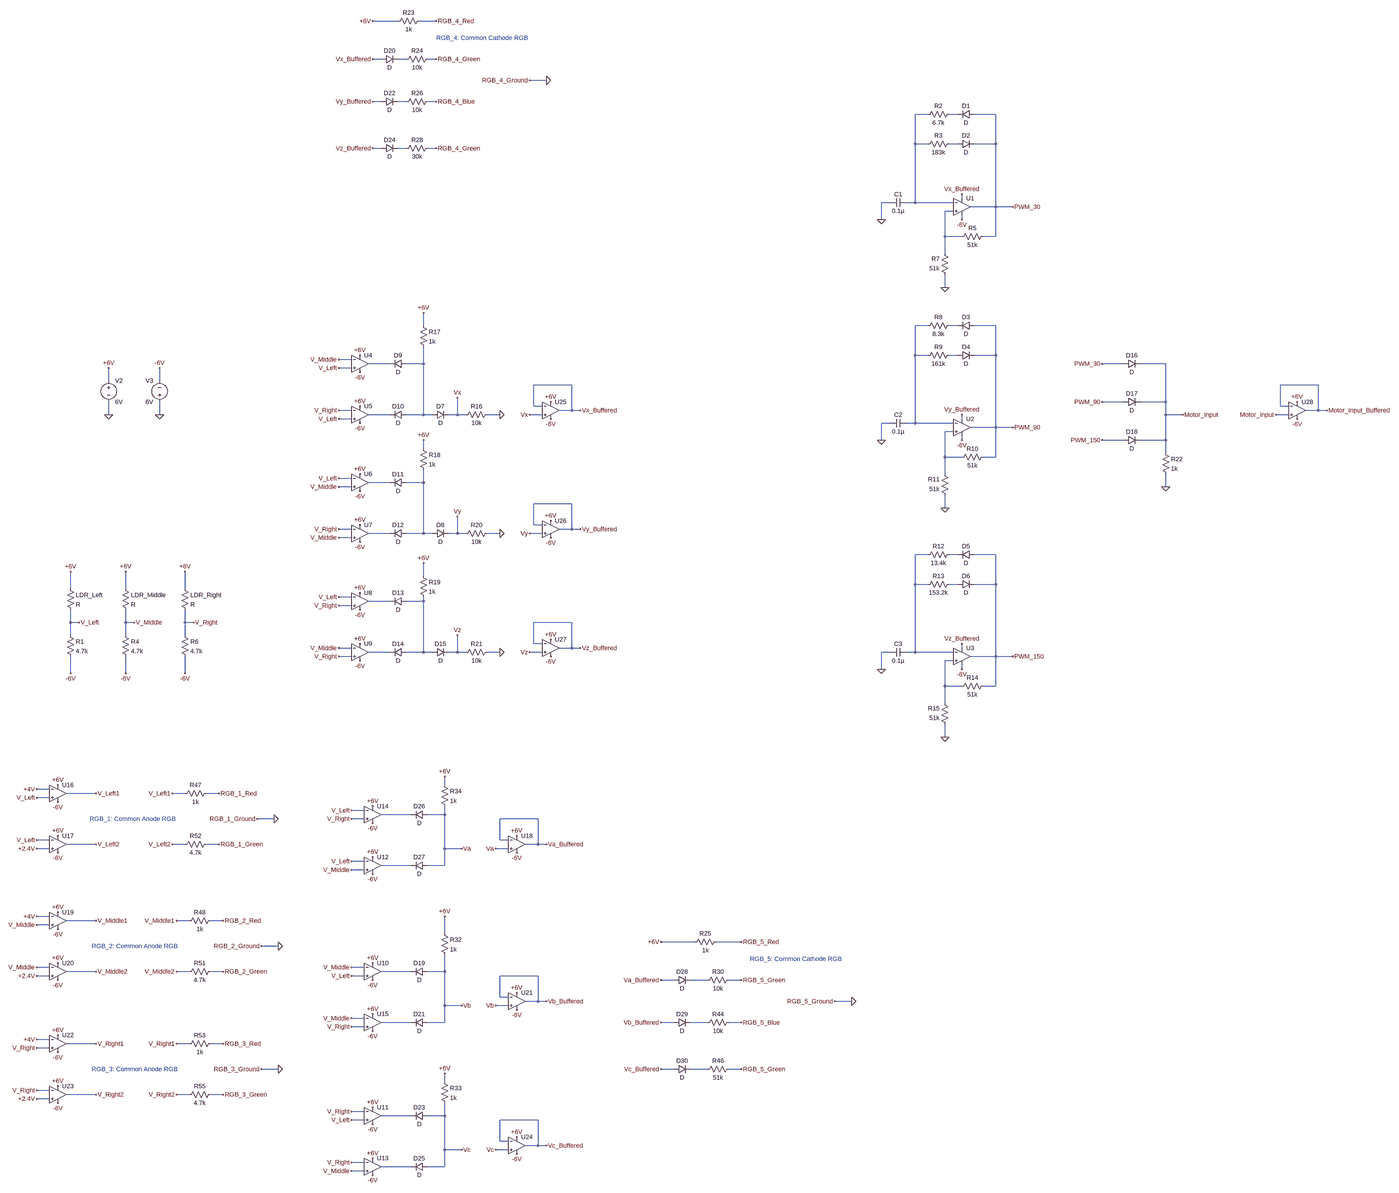
[diagram p0: schematic Project Schematic.asc, whole sheet]
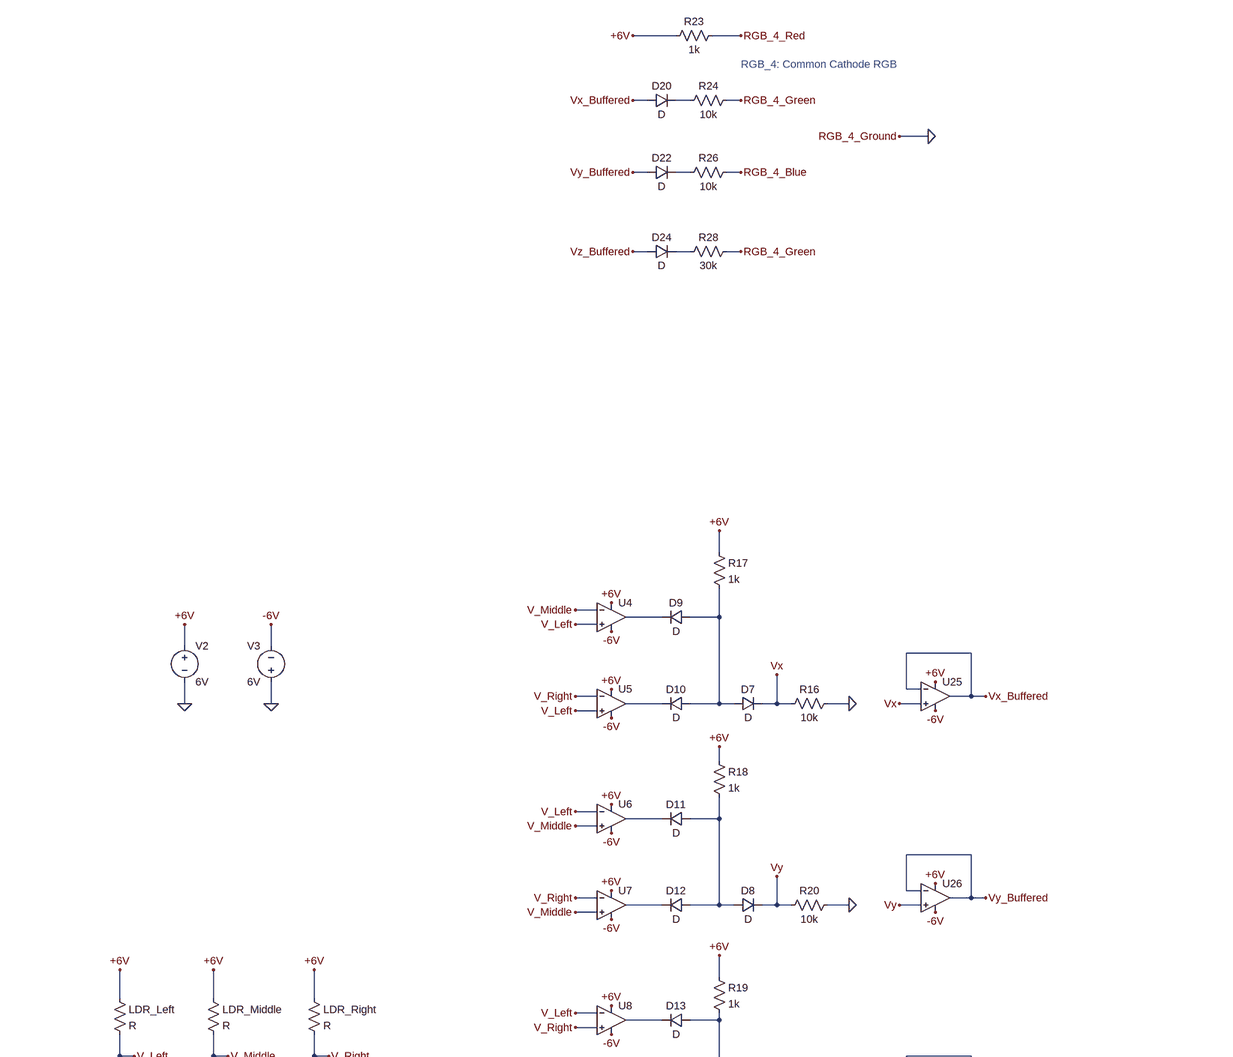
[diagram p1: schematic Project Schematic.asc, part, row 1 of 2, column 1 of 2]
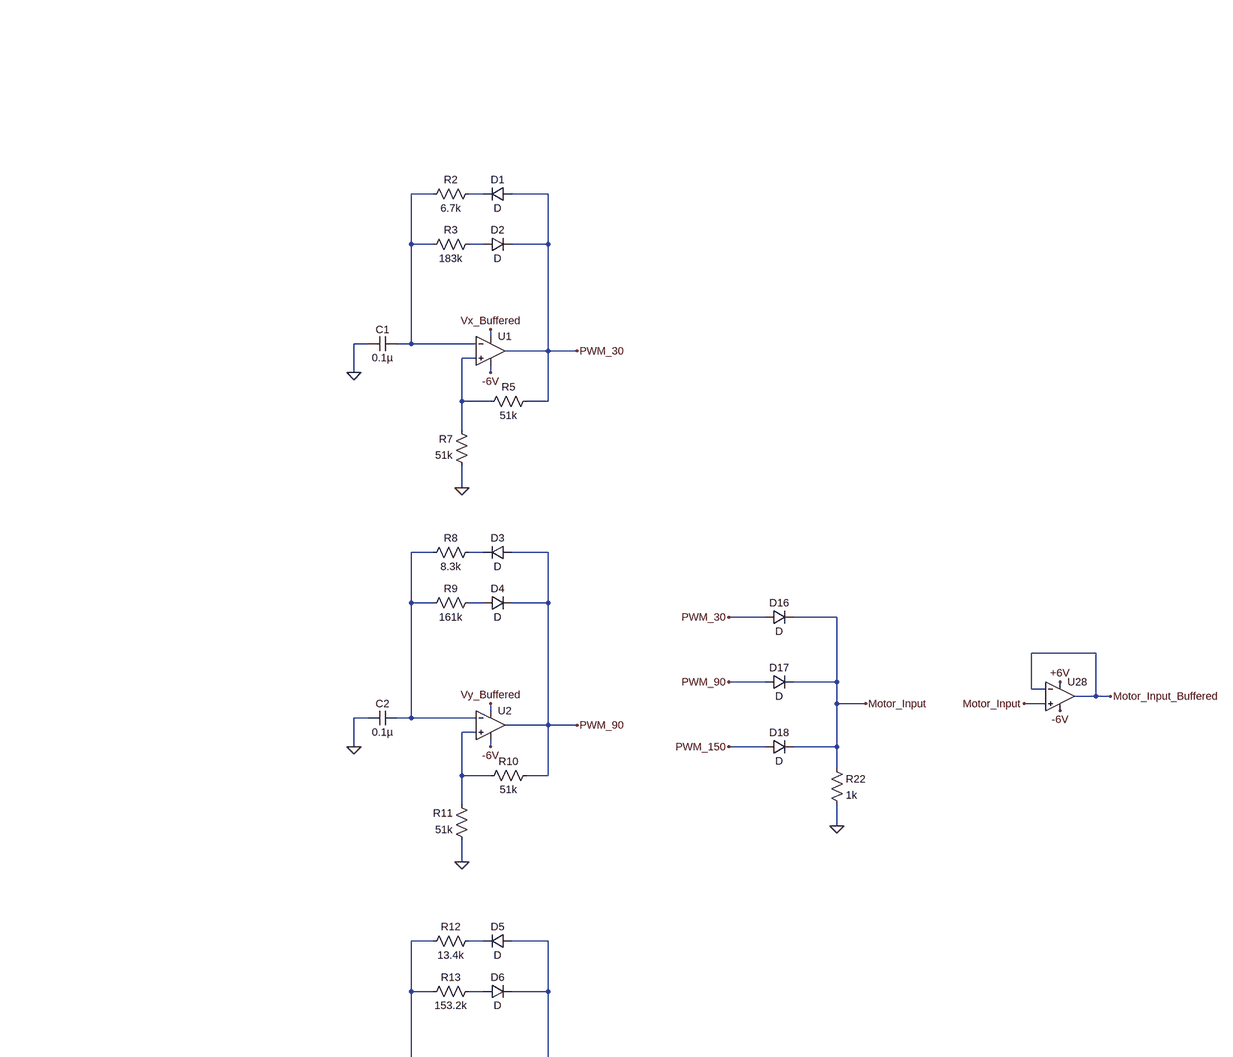
[diagram p2: schematic Project Schematic.asc, part, row 1 of 2, column 2 of 2]
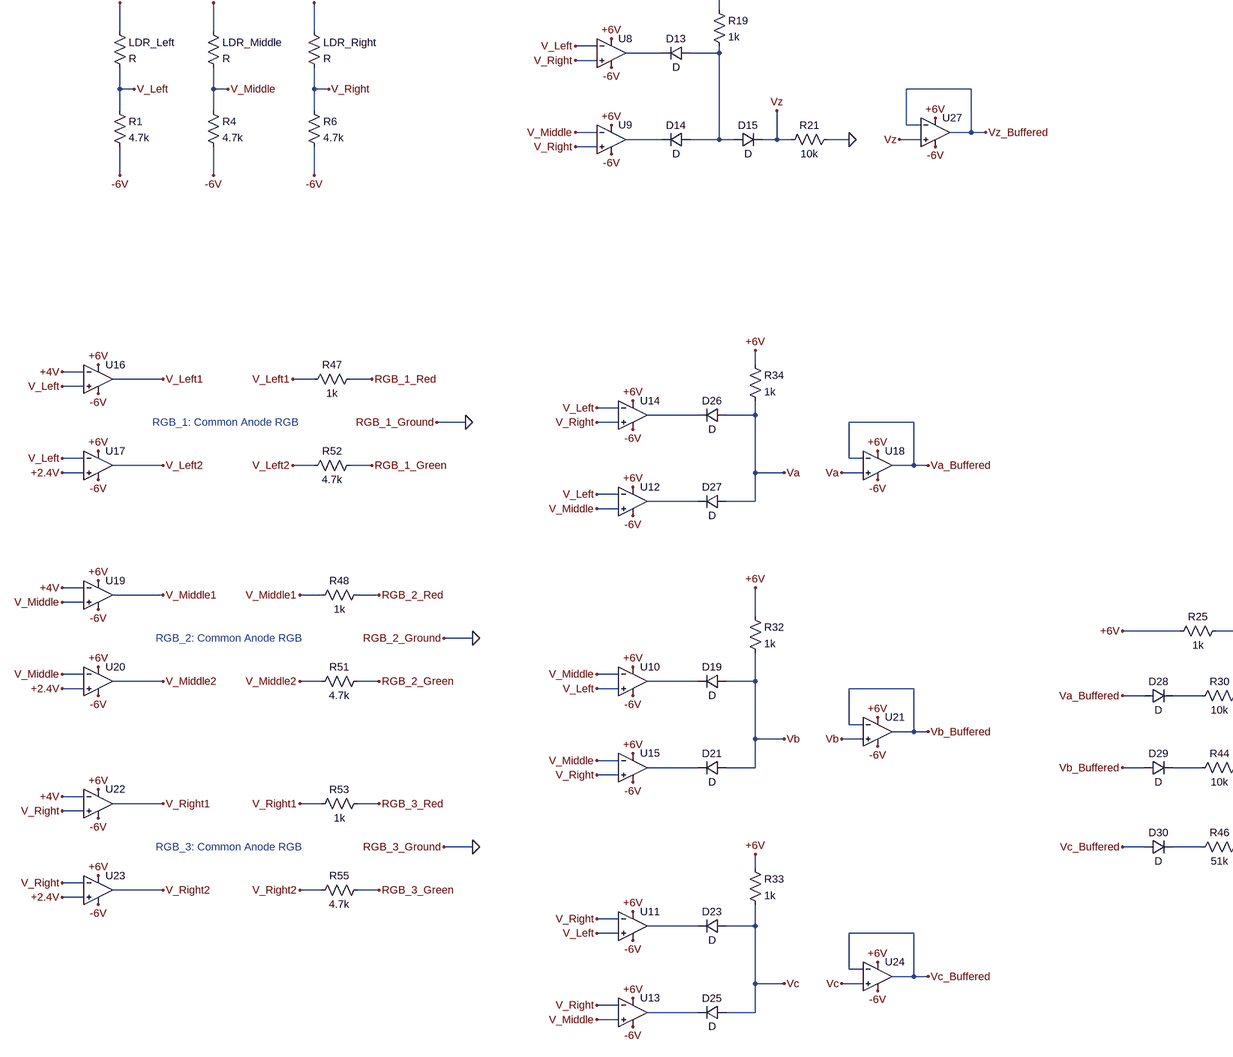
[diagram p3: schematic Project Schematic.asc, part, row 2 of 2, column 1 of 2]
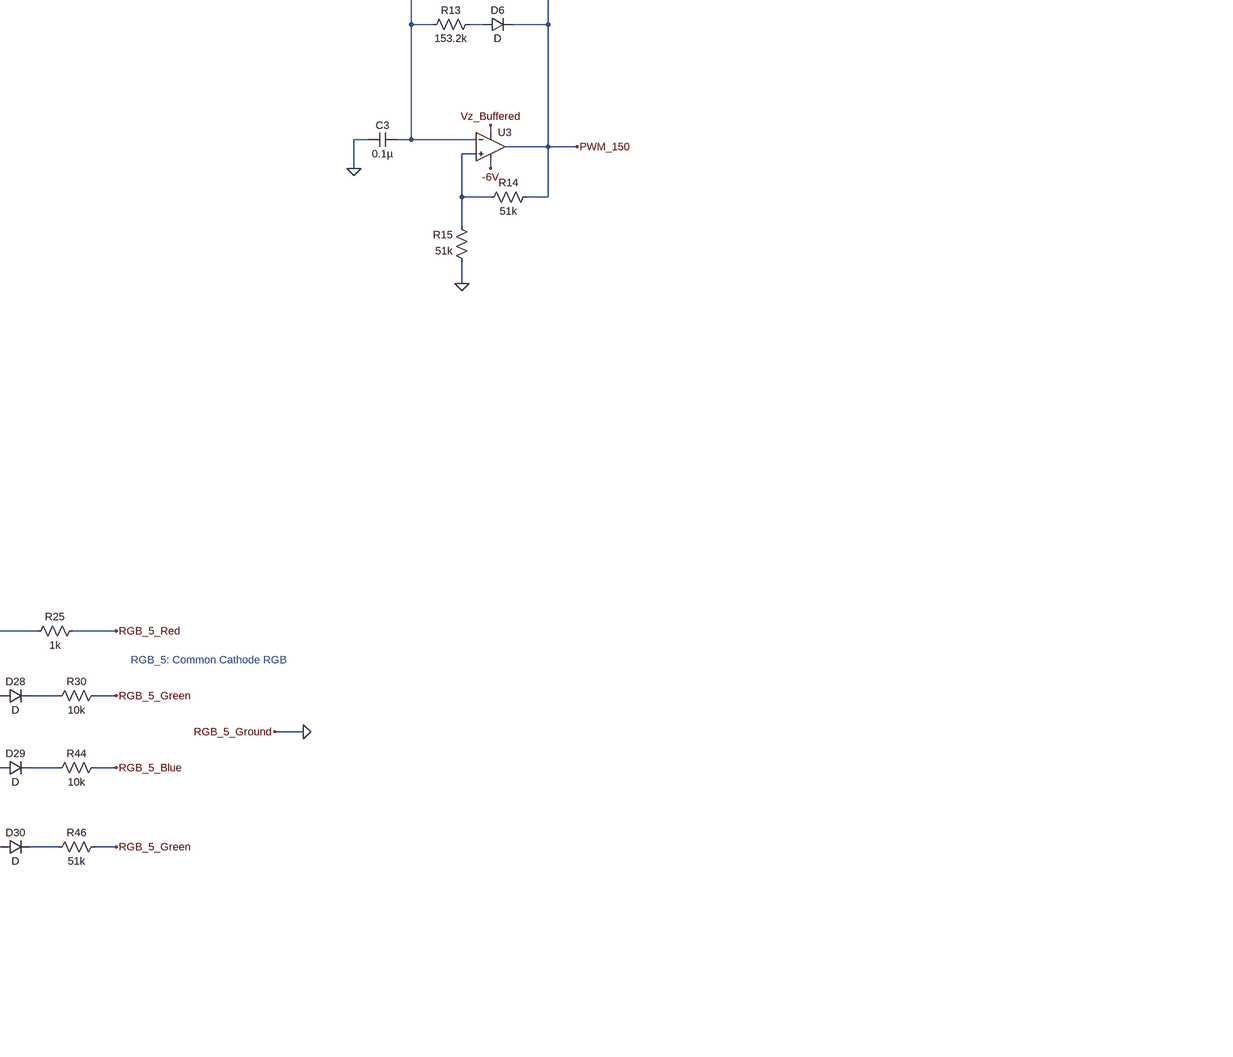
[diagram p4: schematic Project Schematic.asc, part, row 2 of 2, column 2 of 2]
Project Schematic.asc, the LTspice schematic file:
Version 4
SHEET 1 7268 3324
WIRE 2224 -2096 2128 -2096
WIRE 2368 -2096 2304 -2096
WIRE 2160 -1952 2128 -1952
WIRE 2256 -1952 2224 -1952
WIRE 2368 -1952 2336 -1952
WIRE 2784 -1872 2720 -1872
WIRE 2160 -1792 2128 -1792
WIRE 2256 -1792 2224 -1792
WIRE 2368 -1792 2336 -1792
WIRE 4224 -1744 4176 -1744
WIRE 4336 -1744 4304 -1744
WIRE 4480 -1744 4400 -1744
WIRE 4176 -1632 4176 -1744
WIRE 4224 -1632 4176 -1632
WIRE 4336 -1632 4304 -1632
WIRE 4480 -1632 4480 -1744
WIRE 4480 -1632 4400 -1632
WIRE 2160 -1616 2128 -1616
WIRE 2256 -1616 2224 -1616
WIRE 2368 -1616 2336 -1616
WIRE 4352 -1392 4352 -1408
WIRE 4080 -1376 4048 -1376
WIRE 4176 -1376 4176 -1632
WIRE 4176 -1376 4144 -1376
WIRE 4320 -1376 4176 -1376
WIRE 4480 -1360 4480 -1632
WIRE 4480 -1360 4384 -1360
WIRE 4544 -1360 4480 -1360
WIRE 4320 -1344 4288 -1344
WIRE 4048 -1312 4048 -1376
WIRE 4352 -1312 4352 -1328
WIRE 4288 -1248 4288 -1344
WIRE 4352 -1248 4288 -1248
WIRE 4480 -1248 4480 -1360
WIRE 4480 -1248 4432 -1248
WIRE 4288 -1184 4288 -1248
WIRE 4288 -1056 4288 -1104
WIRE 2320 -912 2320 -960
WIRE 4224 -912 4176 -912
WIRE 4336 -912 4304 -912
WIRE 4480 -912 4400 -912
WIRE 4176 -800 4176 -912
WIRE 4224 -800 4176 -800
WIRE 4336 -800 4304 -800
WIRE 4480 -800 4480 -912
WIRE 4480 -800 4400 -800
WIRE 2048 -784 2000 -784
WIRE 2192 -768 2112 -768
WIRE 2320 -768 2320 -832
WIRE 2320 -768 2256 -768
WIRE 5120 -768 5040 -768
WIRE 5280 -768 5184 -768
WIRE 2048 -752 2000 -752
WIRE 480 -704 480 -752
WIRE 672 -704 672 -752
WIRE 2880 -688 2736 -688
WIRE 5856 -688 5712 -688
WIRE 5120 -624 5040 -624
WIRE 5280 -624 5280 -768
WIRE 5280 -624 5184 -624
WIRE 2736 -608 2736 -688
WIRE 2768 -608 2736 -608
WIRE 5712 -608 5712 -688
WIRE 5744 -608 5712 -608
WIRE 2048 -592 2000 -592
WIRE 2880 -592 2880 -688
WIRE 2880 -592 2832 -592
WIRE 2912 -592 2880 -592
WIRE 5856 -592 5856 -688
WIRE 5856 -592 5808 -592
WIRE 5888 -592 5856 -592
WIRE 480 -576 480 -624
WIRE 672 -576 672 -624
WIRE 2192 -576 2112 -576
WIRE 2320 -576 2320 -768
WIRE 2320 -576 2256 -576
WIRE 2352 -576 2320 -576
WIRE 2448 -576 2448 -640
WIRE 2448 -576 2416 -576
WIRE 2480 -576 2448 -576
WIRE 2608 -576 2560 -576
WIRE 2768 -576 2720 -576
WIRE 5280 -576 5280 -624
WIRE 5344 -576 5280 -576
WIRE 5744 -576 5696 -576
WIRE 2048 -560 2000 -560
WIRE 4352 -560 4352 -576
WIRE 4080 -544 4048 -544
WIRE 4176 -544 4176 -800
WIRE 4176 -544 4144 -544
WIRE 4320 -544 4176 -544
WIRE 4480 -528 4480 -800
WIRE 4480 -528 4384 -528
WIRE 4544 -528 4480 -528
WIRE 4320 -512 4288 -512
WIRE 4048 -480 4048 -544
WIRE 4352 -480 4352 -496
WIRE 5120 -480 5040 -480
WIRE 5280 -480 5280 -576
WIRE 5280 -480 5184 -480
WIRE 2320 -448 2320 -480
WIRE 5280 -432 5280 -480
WIRE 4288 -416 4288 -512
WIRE 4352 -416 4288 -416
WIRE 4480 -416 4480 -528
WIRE 4480 -416 4432 -416
WIRE 4288 -352 4288 -416
WIRE 2048 -336 2000 -336
WIRE 2192 -320 2112 -320
WIRE 2320 -320 2320 -368
WIRE 2320 -320 2256 -320
WIRE 2048 -304 2000 -304
WIRE 5280 -304 5280 -352
WIRE 2880 -240 2736 -240
WIRE 4288 -224 4288 -272
WIRE 2736 -160 2736 -240
WIRE 2768 -160 2736 -160
WIRE 2048 -144 2000 -144
WIRE 2880 -144 2880 -240
WIRE 2880 -144 2832 -144
WIRE 2912 -144 2880 -144
WIRE 2192 -128 2112 -128
WIRE 2320 -128 2320 -320
WIRE 2320 -128 2256 -128
WIRE 2352 -128 2320 -128
WIRE 2448 -128 2448 -192
WIRE 2448 -128 2416 -128
WIRE 2480 -128 2448 -128
WIRE 2608 -128 2560 -128
WIRE 2768 -128 2720 -128
WIRE 2048 -112 2000 -112
WIRE 4224 -48 4176 -48
WIRE 4336 -48 4304 -48
WIRE 4480 -48 4400 -48
WIRE 2320 32 2320 -16
WIRE 4176 64 4176 -48
WIRE 4224 64 4176 64
WIRE 4336 64 4304 64
WIRE 4480 64 4480 -48
WIRE 4480 64 4400 64
WIRE 336 80 336 16
WIRE 544 80 544 16
WIRE 768 80 768 16
WIRE 2048 112 2000 112
WIRE 2192 128 2112 128
WIRE 2320 128 2320 112
WIRE 2320 128 2256 128
WIRE 2048 144 2000 144
WIRE 336 208 336 160
WIRE 368 208 336 208
WIRE 544 208 544 160
WIRE 576 208 544 208
WIRE 768 208 768 160
WIRE 800 208 768 208
WIRE 2880 208 2736 208
WIRE 336 256 336 208
WIRE 544 256 544 208
WIRE 768 256 768 208
WIRE 2736 288 2736 208
WIRE 2768 288 2736 288
WIRE 2048 304 2000 304
WIRE 2880 304 2880 208
WIRE 2880 304 2832 304
WIRE 2912 304 2880 304
WIRE 4352 304 4352 288
WIRE 2192 320 2112 320
WIRE 2320 320 2320 128
WIRE 2320 320 2256 320
WIRE 2352 320 2320 320
WIRE 2448 320 2448 256
WIRE 2448 320 2416 320
WIRE 2480 320 2448 320
WIRE 2608 320 2560 320
WIRE 2768 320 2720 320
WIRE 4080 320 4048 320
WIRE 4176 320 4176 64
WIRE 4176 320 4144 320
WIRE 4320 320 4176 320
WIRE 2048 336 2000 336
WIRE 4480 336 4480 64
WIRE 4480 336 4384 336
WIRE 4544 336 4480 336
WIRE 4320 352 4288 352
WIRE 4048 384 4048 320
WIRE 4352 384 4352 368
WIRE 336 400 336 336
WIRE 544 400 544 336
WIRE 768 400 768 336
WIRE 4288 448 4288 352
WIRE 4352 448 4288 448
WIRE 4480 448 4480 336
WIRE 4480 448 4432 448
WIRE 4288 512 4288 448
WIRE 4288 640 4288 592
WIRE 2400 1104 2400 1072
WIRE 256 1120 208 1120
WIRE 432 1136 320 1136
WIRE 768 1136 720 1136
WIRE 896 1136 848 1136
WIRE 256 1152 208 1152
WIRE 2096 1200 2048 1200
WIRE 2272 1216 2160 1216
WIRE 2400 1216 2400 1184
WIRE 2400 1216 2336 1216
WIRE 1104 1232 1040 1232
WIRE 2096 1232 2048 1232
WIRE 2752 1232 2608 1232
WIRE 256 1312 208 1312
WIRE 2608 1312 2608 1232
WIRE 2640 1312 2608 1312
WIRE 432 1328 320 1328
WIRE 768 1328 720 1328
WIRE 896 1328 848 1328
WIRE 2752 1328 2752 1232
WIRE 2752 1328 2704 1328
WIRE 2784 1328 2752 1328
WIRE 256 1344 208 1344
WIRE 2400 1344 2400 1216
WIRE 2464 1344 2400 1344
WIRE 2640 1344 2592 1344
WIRE 2096 1392 2048 1392
WIRE 2272 1408 2160 1408
WIRE 2400 1408 2400 1344
WIRE 2400 1408 2336 1408
WIRE 2096 1424 2048 1424
WIRE 256 1600 208 1600
WIRE 432 1616 320 1616
WIRE 784 1616 736 1616
WIRE 912 1616 864 1616
WIRE 256 1632 208 1632
WIRE 2400 1664 2400 1600
WIRE 3344 1696 3216 1696
WIRE 3520 1696 3424 1696
WIRE 1120 1712 1056 1712
WIRE 256 1792 208 1792
WIRE 2096 1792 2048 1792
WIRE 432 1808 320 1808
WIRE 784 1808 736 1808
WIRE 912 1808 864 1808
WIRE 2272 1808 2160 1808
WIRE 2400 1808 2400 1744
WIRE 2400 1808 2336 1808
WIRE 256 1824 208 1824
WIRE 2096 1824 2048 1824
WIRE 2752 1824 2608 1824
WIRE 3264 1840 3216 1840
WIRE 3392 1840 3328 1840
WIRE 3520 1840 3472 1840
WIRE 2608 1904 2608 1824
WIRE 2640 1904 2608 1904
WIRE 2752 1920 2752 1824
WIRE 2752 1920 2704 1920
WIRE 2784 1920 2752 1920
WIRE 3936 1920 3872 1920
WIRE 2400 1936 2400 1808
WIRE 2464 1936 2400 1936
WIRE 2640 1936 2592 1936
WIRE 2096 1984 2048 1984
WIRE 2272 2000 2160 2000
WIRE 2400 2000 2400 1936
WIRE 2400 2000 2336 2000
WIRE 3264 2000 3216 2000
WIRE 3392 2000 3328 2000
WIRE 3520 2000 3472 2000
WIRE 2096 2016 2048 2016
WIRE 256 2064 208 2064
WIRE 432 2080 320 2080
WIRE 784 2080 736 2080
WIRE 912 2080 864 2080
WIRE 256 2096 208 2096
WIRE 1120 2176 1056 2176
WIRE 3264 2176 3216 2176
WIRE 3392 2176 3328 2176
WIRE 3520 2176 3472 2176
WIRE 2400 2224 2400 2192
WIRE 256 2256 208 2256
WIRE 432 2272 320 2272
WIRE 784 2272 736 2272
WIRE 912 2272 864 2272
WIRE 256 2288 208 2288
WIRE 2096 2336 2048 2336
WIRE 2272 2352 2160 2352
WIRE 2400 2352 2400 2304
WIRE 2400 2352 2336 2352
WIRE 2096 2368 2048 2368
WIRE 2752 2368 2608 2368
WIRE 2608 2448 2608 2368
WIRE 2640 2448 2608 2448
WIRE 2752 2464 2752 2368
WIRE 2752 2464 2704 2464
WIRE 2784 2464 2752 2464
WIRE 2400 2480 2400 2352
WIRE 2464 2480 2400 2480
WIRE 2640 2480 2592 2480
WIRE 2096 2528 2048 2528
WIRE 2272 2544 2160 2544
WIRE 2400 2544 2400 2480
WIRE 2400 2544 2336 2544
WIRE 2096 2560 2048 2560
FLAG 368 208 V_Left
FLAG 576 208 V_Middle
FLAG 800 208 V_Right
FLAG 4048 -1312 0
FLAG 4288 -1056 0
FLAG 4048 -480 0
FLAG 4288 -224 0
FLAG 4048 384 0
FLAG 4288 640 0
FLAG 4352 -1408 Vx_Buffered
FLAG 4352 -576 Vy_Buffered
FLAG 4352 288 Vz_Buffered
FLAG 2000 -560 V_Left
FLAG 2000 -752 V_Left
FLAG 2000 -784 V_Middle
FLAG 2000 -304 V_Middle
FLAG 2000 -112 V_Middle
FLAG 2000 304 V_Middle
FLAG 2000 -592 V_Right
FLAG 2000 -144 V_Right
FLAG 2000 144 V_Right
FLAG 2000 336 V_Right
FLAG 2000 -336 V_Left
FLAG 2000 112 V_Left
FLAG 4544 -1360 PWM_30
FLAG 4544 -528 PWM_90
FLAG 4544 336 PWM_150
FLAG 672 -576 0
FLAG 480 -576 0
FLAG 2608 -576 0
FLAG 2608 -128 0
FLAG 2608 320 0
FLAG 2448 -640 Vx
FLAG 2448 -192 Vy
FLAG 2448 256 Vz
FLAG 480 -752 +6V
FLAG 2080 -800 +6V
FLAG 2080 -352 +6V
FLAG 2080 -608 +6V
FLAG 2080 -160 +6V
FLAG 2080 96 +6V
FLAG 2080 288 +6V
FLAG 2320 -16 +6V
FLAG 2320 -480 +6V
FLAG 2320 -960 +6V
FLAG 672 -752 -6V
FLAG 2080 -288 -6V
FLAG 2080 -96 -6V
FLAG 2080 160 -6V
FLAG 2080 352 -6V
FLAG 2080 -736 -6V
FLAG 2080 -544 -6V
FLAG 5040 -768 PWM_30
FLAG 5040 -624 PWM_90
FLAG 5040 -480 PWM_150
FLAG 5280 -304 0
FLAG 5344 -576 Motor_Input
FLAG 2128 -1952 Vx_Buffered
FLAG 2128 -1792 Vy_Buffered
FLAG 2128 -1616 Vz_Buffered
FLAG 2368 -1792 RGB_4_Blue
FLAG 2368 -1952 RGB_4_Green
FLAG 2368 -1616 RGB_4_Green
FLAG 2784 -1872 0
FLAG 2720 -1872 RGB_4_Ground
FLAG 4352 -1312 -6V
FLAG 4352 384 -6V
FLAG 4352 -480 -6V
FLAG 336 16 +6V
FLAG 544 16 +6V
FLAG 768 16 +6V
FLAG 336 400 -6V
FLAG 544 400 -6V
FLAG 768 400 -6V
FLAG 2048 2368 V_Left
FLAG 2048 1824 V_Left
FLAG 2048 1792 V_Middle
FLAG 2048 1424 V_Middle
FLAG 2048 2560 V_Middle
FLAG 2048 1984 V_Middle
FLAG 2048 2336 V_Right
FLAG 2048 2528 V_Right
FLAG 2048 1232 V_Right
FLAG 2048 2016 V_Right
FLAG 2048 1392 V_Left
FLAG 2048 1200 V_Left
FLAG 2128 1776 +6V
FLAG 2128 1376 +6V
FLAG 2128 2320 +6V
FLAG 2128 2512 +6V
FLAG 2128 1184 +6V
FLAG 2128 1968 +6V
FLAG 2128 1440 -6V
FLAG 2128 2576 -6V
FLAG 2128 1248 -6V
FLAG 2128 2032 -6V
FLAG 2128 1840 -6V
FLAG 2128 2384 -6V
FLAG 208 1152 V_Left
FLAG 208 1312 V_Left
FLAG 208 1120 +4V
FLAG 288 1104 +6V
FLAG 288 1296 +6V
FLAG 288 1168 -6V
FLAG 288 1360 -6V
FLAG 208 1632 V_Middle
FLAG 208 1792 V_Middle
FLAG 208 1600 +4V
FLAG 288 1584 +6V
FLAG 288 1776 +6V
FLAG 288 1648 -6V
FLAG 288 1840 -6V
FLAG 208 2096 V_Right
FLAG 208 2256 V_Right
FLAG 208 2064 +4V
FLAG 288 2048 +6V
FLAG 288 2240 +6V
FLAG 288 2112 -6V
FLAG 288 2304 -6V
FLAG 432 1136 V_Left1
FLAG 432 1328 V_Left2
FLAG 432 1616 V_Middle1
FLAG 432 1808 V_Middle2
FLAG 432 2080 V_Right1
FLAG 432 2272 V_Right2
FLAG 3216 1840 Va_Buffered
FLAG 3216 2000 Vb_Buffered
FLAG 3216 2176 Vc_Buffered
FLAG 3520 2000 RGB_5_Blue
FLAG 3520 1840 RGB_5_Green
FLAG 3520 2176 RGB_5_Green
FLAG 3936 1920 0
FLAG 3872 1920 RGB_5_Ground
FLAG 720 1136 V_Left1
FLAG 720 1328 V_Left2
FLAG 896 1136 RGB_1_Red
FLAG 896 1328 RGB_1_Green
FLAG 1104 1232 0
FLAG 1040 1232 RGB_1_Ground
FLAG 736 1616 V_Middle1
FLAG 736 1808 V_Middle2
FLAG 912 1616 RGB_2_Red
FLAG 912 1808 RGB_2_Green
FLAG 1120 1712 0
FLAG 1056 1712 RGB_2_Ground
FLAG 736 2080 V_Right1
FLAG 736 2272 V_Right2
FLAG 912 2080 RGB_3_Red
FLAG 912 2272 RGB_3_Green
FLAG 1120 2176 0
FLAG 1056 2176 RGB_3_Ground
FLAG 208 1344 +2.4V
FLAG 208 1824 +2.4V
FLAG 208 2288 +2.4V
FLAG 2368 -2096 RGB_4_Red
FLAG 2128 -2096 +6V
FLAG 2400 1600 +6V
FLAG 2400 2192 +6V
FLAG 2400 1072 +6V
FLAG 2464 1344 Va
FLAG 2464 1936 Vb
FLAG 2464 2480 Vc
FLAG 3520 1696 RGB_5_Red
FLAG 3216 1696 +6V
FLAG 2672 1296 +6V
FLAG 2672 1360 -6V
FLAG 2592 1344 Va
FLAG 2784 1328 Va_Buffered
FLAG 2672 1888 +6V
FLAG 2672 1952 -6V
FLAG 2592 1936 Vb
FLAG 2784 1920 Vb_Buffered
FLAG 2672 2432 +6V
FLAG 2672 2496 -6V
FLAG 2592 2480 Vc
FLAG 2784 2464 Vc_Buffered
FLAG 2800 -624 +6V
FLAG 2800 -560 -6V
FLAG 2720 -576 Vx
FLAG 2912 -592 Vx_Buffered
FLAG 2800 -176 +6V
FLAG 2800 -112 -6V
FLAG 2720 -128 Vy
FLAG 2912 -144 Vy_Buffered
FLAG 2800 272 +6V
FLAG 2800 336 -6V
FLAG 2720 320 Vz
FLAG 2912 304 Vz_Buffered
FLAG 5776 -624 +6V
FLAG 5776 -560 -6V
FLAG 5696 -576 Motor_Input
FLAG 5888 -592 Motor_Input_Buffered
SYMBOL res 320 240 R0
SYMATTR InstName R1
SYMATTR Value 4.7k
SYMBOL res 320 64 R0
SYMATTR InstName LDR_Left
SYMBOL res 528 64 R0
SYMATTR InstName LDR_Middle
SYMBOL res 528 240 R0
SYMATTR InstName R4
SYMATTR Value 4.7k
SYMBOL res 752 64 R0
SYMATTR InstName LDR_Right
SYMBOL res 752 240 R0
SYMATTR InstName R6
SYMATTR Value 4.7k
SYMBOL Opamps\\UniversalOpamp2 4352 -1360 R0
SYMATTR InstName U1
SYMBOL diode 4400 -1760 R90
WINDOW 0 0 32 VBottom 2
WINDOW 3 32 32 VTop 2
SYMATTR InstName D1
SYMBOL diode 4336 -1616 R270
WINDOW 0 32 32 VTop 2
WINDOW 3 0 32 VBottom 2
SYMATTR InstName D2
SYMBOL res 4320 -1760 R90
WINDOW 0 0 56 VBottom 2
WINDOW 3 32 56 VTop 2
SYMATTR InstName R2
SYMATTR Value 6.7k
SYMBOL res 4320 -1648 R90
WINDOW 0 0 56 VBottom 2
WINDOW 3 32 56 VTop 2
SYMATTR InstName R3
SYMATTR Value 183k
SYMBOL cap 4144 -1392 R90
WINDOW 0 0 32 VBottom 2
WINDOW 3 32 32 VTop 2
SYMATTR InstName C1
SYMATTR Value 0.1µ
SYMBOL res 4448 -1264 R90
WINDOW 0 0 56 VBottom 2
WINDOW 3 32 56 VTop 2
SYMATTR InstName R5
SYMATTR Value 51k
SYMBOL res 4304 -1088 R180
WINDOW 0 36 76 Left 2
WINDOW 3 36 40 Left 2
SYMATTR InstName R7
SYMATTR Value 51k
SYMBOL Opamps\\UniversalOpamp2 4352 -528 R0
SYMATTR InstName U2
SYMBOL diode 4400 -928 R90
WINDOW 0 0 32 VBottom 2
WINDOW 3 32 32 VTop 2
SYMATTR InstName D3
SYMBOL diode 4336 -784 R270
WINDOW 0 32 32 VTop 2
WINDOW 3 0 32 VBottom 2
SYMATTR InstName D4
SYMBOL res 4320 -928 R90
WINDOW 0 0 56 VBottom 2
WINDOW 3 32 56 VTop 2
SYMATTR InstName R8
SYMATTR Value 8.3k
SYMBOL res 4320 -816 R90
WINDOW 0 0 56 VBottom 2
WINDOW 3 32 56 VTop 2
SYMATTR InstName R9
SYMATTR Value 161k
SYMBOL cap 4144 -560 R90
WINDOW 0 0 32 VBottom 2
WINDOW 3 32 32 VTop 2
SYMATTR InstName C2
SYMATTR Value 0.1µ
SYMBOL res 4448 -432 R90
WINDOW 0 0 56 VBottom 2
WINDOW 3 32 56 VTop 2
SYMATTR InstName R10
SYMATTR Value 51k
SYMBOL res 4304 -256 R180
WINDOW 0 36 76 Left 2
WINDOW 3 36 40 Left 2
SYMATTR InstName R11
SYMATTR Value 51k
SYMBOL Opamps\\UniversalOpamp2 4352 336 R0
SYMATTR InstName U3
SYMBOL diode 4400 -64 R90
WINDOW 0 0 32 VBottom 2
WINDOW 3 32 32 VTop 2
SYMATTR InstName D5
SYMBOL diode 4336 80 R270
WINDOW 0 32 32 VTop 2
WINDOW 3 0 32 VBottom 2
SYMATTR InstName D6
SYMBOL res 4320 -64 R90
WINDOW 0 0 56 VBottom 2
WINDOW 3 32 56 VTop 2
SYMATTR InstName R12
SYMATTR Value 13.4k
SYMBOL res 4320 48 R90
WINDOW 0 0 56 VBottom 2
WINDOW 3 32 56 VTop 2
SYMATTR InstName R13
SYMATTR Value 153.2k
SYMBOL cap 4144 304 R90
WINDOW 0 0 32 VBottom 2
WINDOW 3 32 32 VTop 2
SYMATTR InstName C3
SYMATTR Value 0.1µ
SYMBOL res 4448 432 R90
WINDOW 0 0 56 VBottom 2
WINDOW 3 32 56 VTop 2
SYMATTR InstName R14
SYMATTR Value 51k
SYMBOL res 4304 608 R180
WINDOW 0 36 76 Left 2
WINDOW 3 36 40 Left 2
SYMATTR InstName R15
SYMATTR Value 51k
SYMBOL Opamps\\UniversalOpamp2 2080 -768 R0
SYMATTR InstName U4
SYMBOL Opamps\\UniversalOpamp2 2080 -576 R0
SYMATTR InstName U5
SYMBOL Opamps\\UniversalOpamp2 2080 -320 R0
SYMATTR InstName U6
SYMBOL Opamps\\UniversalOpamp2 2080 -128 R0
SYMATTR InstName U7
SYMBOL Opamps\\UniversalOpamp2 2080 128 R0
SYMATTR InstName U8
SYMBOL Opamps\\UniversalOpamp2 2080 320 R0
SYMATTR InstName U9
SYMBOL diode 2256 -784 R90
WINDOW 0 0 32 VBottom 2
WINDOW 3 32 32 VTop 2
SYMATTR InstName D9
SYMBOL diode 2256 -592 R90
WINDOW 0 0 32 VBottom 2
WINDOW 3 32 32 VTop 2
SYMATTR InstName D10
SYMBOL diode 2256 -336 R90
WINDOW 0 0 32 VBottom 2
WINDOW 3 32 32 VTop 2
SYMATTR InstName D11
SYMBOL diode 2256 -144 R90
WINDOW 0 0 32 VBottom 2
WINDOW 3 32 32 VTop 2
SYMATTR InstName D12
SYMBOL diode 2256 112 R90
WINDOW 0 0 32 VBottom 2
WINDOW 3 32 32 VTop 2
SYMATTR InstName D13
SYMBOL diode 2256 304 R90
WINDOW 0 0 32 VBottom 2
WINDOW 3 32 32 VTop 2
SYMATTR InstName D14
SYMBOL voltage 480 -720 R0
WINDOW 123 0 0 Left 2
WINDOW 39 0 0 Left 2
SYMATTR InstName V2
SYMATTR Value 6V
SYMBOL voltage 672 -608 R180
WINDOW 0 24 96 Left 2
WINDOW 3 24 16 Left 2
WINDOW 123 0 0 Left 2
WINDOW 39 0 0 Left 2
SYMATTR InstName V3
SYMATTR Value 6V
SYMBOL diode 2352 -560 R270
WINDOW 0 32 32 VTop 2
WINDOW 3 0 32 VBottom 2
SYMATTR InstName D7
SYMBOL diode 2352 -112 R270
WINDOW 0 32 32 VTop 2
WINDOW 3 0 32 VBottom 2
SYMATTR InstName D8
SYMBOL diode 2352 336 R270
WINDOW 0 32 32 VTop 2
WINDOW 3 0 32 VBottom 2
SYMATTR InstName D15
SYMBOL res 2576 -592 R90
WINDOW 0 0 56 VBottom 2
WINDOW 3 32 56 VTop 2
SYMATTR InstName R16
SYMATTR Value 10k
SYMBOL res 2576 -144 R90
WINDOW 0 0 56 VBottom 2
WINDOW 3 32 56 VTop 2
SYMATTR InstName R20
SYMATTR Value 10k
SYMBOL res 2576 304 R90
WINDOW 0 0 56 VBottom 2
WINDOW 3 32 56 VTop 2
SYMATTR InstName R21
SYMATTR Value 10k
SYMBOL res 2304 -928 R0
SYMATTR InstName R17
SYMATTR Value 1k
SYMBOL res 2304 -464 R0
SYMATTR InstName R18
SYMATTR Value 1k
SYMBOL res 2304 16 R0
SYMATTR InstName R19
SYMATTR Value 1k
SYMBOL res 5264 -448 R0
SYMATTR InstName R22
SYMATTR Value 1k
SYMBOL diode 5120 -752 R270
WINDOW 0 32 32 VTop 2
WINDOW 3 0 32 VBottom 2
SYMATTR InstName D16
SYMBOL diode 5120 -608 R270
WINDOW 0 32 32 VTop 2
WINDOW 3 0 32 VBottom 2
SYMATTR InstName D17
SYMBOL diode 5120 -464 R270
WINDOW 0 32 32 VTop 2
WINDOW 3 0 32 VBottom 2
SYMATTR InstName D18
SYMBOL res 2352 -1968 R90
WINDOW 0 0 56 VBottom 2
WINDOW 3 32 56 VTop 2
SYMATTR InstName R24
SYMATTR Value 10k
SYMBOL res 2352 -1808 R90
WINDOW 0 0 56 VBottom 2
WINDOW 3 32 56 VTop 2
SYMATTR InstName R26
SYMATTR Value 10k
SYMBOL res 2352 -1632 R90
WINDOW 0 0 56 VBottom 2
WINDOW 3 32 56 VTop 2
SYMATTR InstName R28
SYMATTR Value 30k
SYMBOL diode 2160 -1936 R270
WINDOW 0 32 32 VTop 2
WINDOW 3 0 32 VBottom 2
SYMATTR InstName D20
SYMBOL diode 2160 -1776 R270
WINDOW 0 32 32 VTop 2
WINDOW 3 0 32 VBottom 2
SYMATTR InstName D22
SYMBOL diode 2160 -1600 R270
WINDOW 0 32 32 VTop 2
WINDOW 3 0 32 VBottom 2
SYMATTR InstName D24
SYMBOL Opamps\\UniversalOpamp2 2128 1808 R0
SYMATTR InstName U10
SYMBOL Opamps\\UniversalOpamp2 2128 2352 R0
SYMATTR InstName U11
SYMBOL Opamps\\UniversalOpamp2 2128 1408 R0
SYMATTR InstName U12
SYMBOL Opamps\\UniversalOpamp2 2128 2544 R0
SYMATTR InstName U13
SYMBOL Opamps\\UniversalOpamp2 2128 1216 R0
SYMATTR InstName U14
SYMBOL Opamps\\UniversalOpamp2 2128 2000 R0
SYMATTR InstName U15
SYMBOL res 2384 1648 R0
SYMATTR InstName R32
SYMATTR Value 1k
SYMBOL res 2384 2208 R0
SYMATTR InstName R33
SYMATTR Value 1k
SYMBOL res 2384 1088 R0
SYMATTR InstName R34
SYMATTR Value 1k
SYMBOL Opamps\\UniversalOpamp2 288 1136 R0
SYMATTR InstName U16
SYMBOL Opamps\\UniversalOpamp2 288 1328 R0
SYMATTR InstName U17
SYMBOL Opamps\\UniversalOpamp2 288 1616 R0
SYMATTR InstName U19
SYMBOL Opamps\\UniversalOpamp2 288 1808 R0
SYMATTR InstName U20
SYMBOL Opamps\\UniversalOpamp2 288 2080 R0
SYMATTR InstName U22
SYMBOL Opamps\\UniversalOpamp2 288 2272 R0
SYMATTR InstName U23
SYMBOL res 3488 1824 R90
WINDOW 0 0 56 VBottom 2
WINDOW 3 32 56 VTop 2
SYMATTR InstName R30
SYMATTR Value 10k
SYMBOL res 3488 1984 R90
WINDOW 0 0 56 VBottom 2
WINDOW 3 32 56 VTop 2
SYMATTR InstName R44
SYMATTR Value 10k
SYMBOL res 3488 2160 R90
WINDOW 0 0 56 VBottom 2
WINDOW 3 32 56 VTop 2
SYMATTR InstName R46
SYMATTR Value 51k
SYMBOL res 864 1120 R90
WINDOW 0 0 56 VBottom 2
WINDOW 3 32 56 VTop 2
SYMATTR InstName R47
SYMATTR Value 1k
SYMBOL res 864 1312 R90
WINDOW 0 0 56 VBottom 2
WINDOW 3 32 56 VTop 2
SYMATTR InstName R52
SYMATTR Value 4.7k
SYMBOL res 880 1600 R90
WINDOW 0 0 56 VBottom 2
WINDOW 3 32 56 VTop 2
SYMATTR InstName R48
SYMATTR Value 1k
SYMBOL res 880 1792 R90
WINDOW 0 0 56 VBottom 2
WINDOW 3 32 56 VTop 2
SYMATTR InstName R51
SYMATTR Value 4.7k
SYMBOL res 880 2064 R90
WINDOW 0 0 56 VBottom 2
WINDOW 3 32 56 VTop 2
SYMATTR InstName R53
SYMATTR Value 1k
SYMBOL res 880 2256 R90
WINDOW 0 0 56 VBottom 2
WINDOW 3 32 56 VTop 2
SYMATTR InstName R55
SYMATTR Value 4.7k
SYMBOL res 2320 -2112 R90
WINDOW 0 0 56 VBottom 2
WINDOW 3 32 56 VTop 2
SYMATTR InstName R23
SYMATTR Value 1k
SYMBOL diode 2336 1792 R90
WINDOW 0 0 32 VBottom 2
WINDOW 3 32 32 VTop 2
SYMATTR InstName D19
SYMBOL diode 2336 1984 R90
WINDOW 0 0 32 VBottom 2
WINDOW 3 32 32 VTop 2
SYMATTR InstName D21
SYMBOL diode 2336 2336 R90
WINDOW 0 0 32 VBottom 2
WINDOW 3 32 32 VTop 2
SYMATTR InstName D23
SYMBOL diode 2336 2528 R90
WINDOW 0 0 32 VBottom 2
WINDOW 3 32 32 VTop 2
SYMATTR InstName D25
SYMBOL diode 2336 1200 R90
WINDOW 0 0 32 VBottom 2
WINDOW 3 32 32 VTop 2
SYMATTR InstName D26
SYMBOL diode 2336 1392 R90
WINDOW 0 0 32 VBottom 2
WINDOW 3 32 32 VTop 2
SYMATTR InstName D27
SYMBOL res 3440 1680 R90
WINDOW 0 0 56 VBottom 2
WINDOW 3 32 56 VTop 2
SYMATTR InstName R25
SYMATTR Value 1k
SYMBOL diode 3264 1856 R270
WINDOW 0 32 32 VTop 2
WINDOW 3 0 32 VBottom 2
SYMATTR InstName D28
SYMBOL diode 3264 2016 R270
WINDOW 0 32 32 VTop 2
WINDOW 3 0 32 VBottom 2
SYMATTR InstName D29
SYMBOL diode 3264 2192 R270
WINDOW 0 32 32 VTop 2
WINDOW 3 0 32 VBottom 2
SYMATTR InstName D30
SYMBOL Opamps\\UniversalOpamp2 2672 1328 R0
SYMATTR InstName U18
SYMBOL Opamps\\UniversalOpamp2 2672 1920 R0
SYMATTR InstName U21
SYMBOL Opamps\\UniversalOpamp2 2672 2464 R0
SYMATTR InstName U24
SYMBOL Opamps\\UniversalOpamp2 2800 -592 R0
SYMATTR InstName U25
SYMBOL Opamps\\UniversalOpamp2 2800 -144 R0
SYMATTR InstName U26
SYMBOL Opamps\\UniversalOpamp2 2800 304 R0
SYMATTR InstName U27
SYMBOL Opamps\\UniversalOpamp2 5776 -592 R0
SYMATTR InstName U28
TEXT 408 1232 Left 2 ;RGB_1: Common Anode RGB
TEXT 416 1712 Left 2 ;RGB_2: Common Anode RGB
TEXT 416 2176 Left 2 ;RGB_3: Common Anode RGB
TEXT 3552 1760 Left 2 ;RGB_5: Common Cathode RGB
TEXT 2368 -2032 Left 2 ;RGB_4: Common Cathode RGB

The netlist it stands for:
* Project Schematic.asc
R1 V_Left -6V 4.7k
R§LDR_Left +6V V_Left R
R§LDR_Middle +6V V_Middle R
R4 V_Middle -6V 4.7k
R§LDR_Right +6V V_Right R
R6 V_Right -6V 4.7k
XU1 N007 N003 Vx_Buffered -6V PWM_30 level.2 Avol=1Meg GBW=10Meg Slew=10Meg ilimit=25m rail=0 Vos=0 phimargin=45 en=0 enk=0 in=0 ink=0 Rin=500Meg  ; pins IN+ IN- V+ V- OUT
D1 PWM_30 N004 D
D2 N005 PWM_30 D
R2 N004 N003 6.7k
R3 N005 N003 183k
C1 N003 0 0.1µ
R5 PWM_30 N007 51k
R7 0 N007 51k
XU2 N014 N008 Vy_Buffered -6V PWM_90 level.2 Avol=1Meg GBW=10Meg Slew=10Meg ilimit=25m rail=0 Vos=0 phimargin=45 en=0 enk=0 in=0 ink=0 Rin=500Meg  ; pins IN+ IN- V+ V- OUT
D3 PWM_90 N009 D
D4 N010 PWM_90 D
R8 N009 N008 8.3k
R9 N010 N008 161k
C2 N008 0 0.1µ
R10 PWM_90 N014 51k
R11 0 N014 51k
XU3 N024 N018 Vz_Buffered -6V PWM_150 level.2 Avol=1Meg GBW=10Meg Slew=10Meg ilimit=25m rail=0 Vos=0 phimargin=45 en=0 enk=0 in=0 ink=0 Rin=500Meg  ; pins IN+ IN- V+ V- OUT
D5 PWM_150 N019 D
D6 N020 PWM_150 D
R12 N019 N018 13.4k
R13 N020 N018 153.2k
C3 N018 0 0.1µ
R14 PWM_150 N024 51k
R15 0 N024 51k
XU4 V_Left V_Middle +6V -6V N011 level.2 Avol=1Meg GBW=10Meg Slew=10Meg ilimit=25m rail=0 Vos=0 phimargin=45 en=0 enk=0 in=0 ink=0 Rin=500Meg  ; pins IN+ IN- V+ V- OUT
XU5 V_Left V_Right +6V -6V N013 level.2 Avol=1Meg GBW=10Meg Slew=10Meg ilimit=25m rail=0 Vos=0 phimargin=45 en=0 enk=0 in=0 ink=0 Rin=500Meg  ; pins IN+ IN- V+ V- OUT
XU6 V_Middle V_Left +6V -6V N015 level.2 Avol=1Meg GBW=10Meg Slew=10Meg ilimit=25m rail=0 Vos=0 phimargin=45 en=0 enk=0 in=0 ink=0 Rin=500Meg  ; pins IN+ IN- V+ V- OUT
XU7 V_Middle V_Right +6V -6V N017 level.2 Avol=1Meg GBW=10Meg Slew=10Meg ilimit=25m rail=0 Vos=0 phimargin=45 en=0 enk=0 in=0 ink=0 Rin=500Meg  ; pins IN+ IN- V+ V- OUT
XU8 V_Right V_Left +6V -6V N021 level.2 Avol=1Meg GBW=10Meg Slew=10Meg ilimit=25m rail=0 Vos=0 phimargin=45 en=0 enk=0 in=0 ink=0 Rin=500Meg  ; pins IN+ IN- V+ V- OUT
XU9 V_Right V_Middle +6V -6V N023 level.2 Avol=1Meg GBW=10Meg Slew=10Meg ilimit=25m rail=0 Vos=0 phimargin=45 en=0 enk=0 in=0 ink=0 Rin=500Meg  ; pins IN+ IN- V+ V- OUT
D9 N012 N011 D
D10 N012 N013 D
D11 N016 N015 D
D12 N016 N017 D
D13 N022 N021 D
D14 N022 N023 D
V2 +6V 0 6V
V3 0 -6V 6V
D7 N012 Vx D
D8 N016 Vy D
D15 N022 Vz D
R16 0 Vx 10k
R20 0 Vy 10k
R21 0 Vz 10k
R17 +6V N012 1k
R18 +6V N016 1k
R19 +6V N022 1k
R22 Motor_Input 0 1k
D16 PWM_30 Motor_Input D
D17 PWM_90 Motor_Input D
D18 PWM_150 Motor_Input D
R24 RGB_4_Green N001 10k
R26 RGB_4_Blue N002 10k
R28 RGB_4_Green N006 30k
D20 Vx_Buffered N001 D
D22 Vy_Buffered N002 D
D24 Vz_Buffered N006 D
XU10 V_Left V_Middle +6V -6V N027 level.2 Avol=1Meg GBW=10Meg Slew=10Meg ilimit=25m rail=0 Vos=0 phimargin=45 en=0 enk=0 in=0 ink=0 Rin=500Meg  ; pins IN+ IN- V+ V- OUT
XU11 V_Left V_Right +6V -6V N032 level.2 Avol=1Meg GBW=10Meg Slew=10Meg ilimit=25m rail=0 Vos=0 phimargin=45 en=0 enk=0 in=0 ink=0 Rin=500Meg  ; pins IN+ IN- V+ V- OUT
XU12 V_Middle V_Left +6V -6V N026 level.2 Avol=1Meg GBW=10Meg Slew=10Meg ilimit=25m rail=0 Vos=0 phimargin=45 en=0 enk=0 in=0 ink=0 Rin=500Meg  ; pins IN+ IN- V+ V- OUT
XU13 V_Middle V_Right +6V -6V N033 level.2 Avol=1Meg GBW=10Meg Slew=10Meg ilimit=25m rail=0 Vos=0 phimargin=45 en=0 enk=0 in=0 ink=0 Rin=500Meg  ; pins IN+ IN- V+ V- OUT
XU14 V_Right V_Left +6V -6V N025 level.2 Avol=1Meg GBW=10Meg Slew=10Meg ilimit=25m rail=0 Vos=0 phimargin=45 en=0 enk=0 in=0 ink=0 Rin=500Meg  ; pins IN+ IN- V+ V- OUT
XU15 V_Right V_Middle +6V -6V N029 level.2 Avol=1Meg GBW=10Meg Slew=10Meg ilimit=25m rail=0 Vos=0 phimargin=45 en=0 enk=0 in=0 ink=0 Rin=500Meg  ; pins IN+ IN- V+ V- OUT
R32 +6V Vb 1k
R33 +6V Vc 1k
R34 +6V Va 1k
XU16 V_Left +4V +6V -6V V_Left1 level.2 Avol=1Meg GBW=10Meg Slew=10Meg ilimit=25m rail=0 Vos=0 phimargin=45 en=0 enk=0 in=0 ink=0 Rin=500Meg  ; pins IN+ IN- V+ V- OUT
XU17 +2.4V V_Left +6V -6V V_Left2 level.2 Avol=1Meg GBW=10Meg Slew=10Meg ilimit=25m rail=0 Vos=0 phimargin=45 en=0 enk=0 in=0 ink=0 Rin=500Meg  ; pins IN+ IN- V+ V- OUT
XU19 V_Middle +4V +6V -6V V_Middle1 level.2 Avol=1Meg GBW=10Meg Slew=10Meg ilimit=25m rail=0 Vos=0 phimargin=45 en=0 enk=0 in=0 ink=0 Rin=500Meg  ; pins IN+ IN- V+ V- OUT
XU20 +2.4V V_Middle +6V -6V V_Middle2 level.2 Avol=1Meg GBW=10Meg Slew=10Meg ilimit=25m rail=0 Vos=0 phimargin=45 en=0 enk=0 in=0 ink=0 Rin=500Meg  ; pins IN+ IN- V+ V- OUT
XU22 V_Right +4V +6V -6V V_Right1 level.2 Avol=1Meg GBW=10Meg Slew=10Meg ilimit=25m rail=0 Vos=0 phimargin=45 en=0 enk=0 in=0 ink=0 Rin=500Meg  ; pins IN+ IN- V+ V- OUT
XU23 +2.4V V_Right +6V -6V V_Right2 level.2 Avol=1Meg GBW=10Meg Slew=10Meg ilimit=25m rail=0 Vos=0 phimargin=45 en=0 enk=0 in=0 ink=0 Rin=500Meg  ; pins IN+ IN- V+ V- OUT
R30 RGB_5_Green N028 10k
R44 RGB_5_Blue N030 10k
R46 RGB_5_Green N031 51k
R47 RGB_1_Red V_Left1 1k
R52 RGB_1_Green V_Left2 4.7k
R48 RGB_2_Red V_Middle1 1k
R51 RGB_2_Green V_Middle2 4.7k
R53 RGB_3_Red V_Right1 1k
R55 RGB_3_Green V_Right2 4.7k
R23 RGB_4_Red +6V 1k
D19 Vb N027 D
D21 Vb N029 D
D23 Vc N032 D
D25 Vc N033 D
D26 Va N025 D
D27 Va N026 D
R25 RGB_5_Red +6V 1k
D28 Va_Buffered N028 D
D29 Vb_Buffered N030 D
D30 Vc_Buffered N031 D
XU18 Va Va_Buffered +6V -6V Va_Buffered level.2 Avol=1Meg GBW=10Meg Slew=10Meg ilimit=25m rail=0 Vos=0 phimargin=45 en=0 enk=0 in=0 ink=0 Rin=500Meg  ; pins IN+ IN- V+ V- OUT
XU21 Vb Vb_Buffered +6V -6V Vb_Buffered level.2 Avol=1Meg GBW=10Meg Slew=10Meg ilimit=25m rail=0 Vos=0 phimargin=45 en=0 enk=0 in=0 ink=0 Rin=500Meg  ; pins IN+ IN- V+ V- OUT
XU24 Vc Vc_Buffered +6V -6V Vc_Buffered level.2 Avol=1Meg GBW=10Meg Slew=10Meg ilimit=25m rail=0 Vos=0 phimargin=45 en=0 enk=0 in=0 ink=0 Rin=500Meg  ; pins IN+ IN- V+ V- OUT
XU25 Vx Vx_Buffered +6V -6V Vx_Buffered level.2 Avol=1Meg GBW=10Meg Slew=10Meg ilimit=25m rail=0 Vos=0 phimargin=45 en=0 enk=0 in=0 ink=0 Rin=500Meg  ; pins IN+ IN- V+ V- OUT
XU26 Vy Vy_Buffered +6V -6V Vy_Buffered level.2 Avol=1Meg GBW=10Meg Slew=10Meg ilimit=25m rail=0 Vos=0 phimargin=45 en=0 enk=0 in=0 ink=0 Rin=500Meg  ; pins IN+ IN- V+ V- OUT
XU27 Vz Vz_Buffered +6V -6V Vz_Buffered level.2 Avol=1Meg GBW=10Meg Slew=10Meg ilimit=25m rail=0 Vos=0 phimargin=45 en=0 enk=0 in=0 ink=0 Rin=500Meg  ; pins IN+ IN- V+ V- OUT
XU28 Motor_Input Motor_Input_Buffered +6V -6V Motor_Input_Buffered level.2 Avol=1Meg GBW=10Meg Slew=10Meg ilimit=25m rail=0 Vos=0 phimargin=45 en=0 enk=0 in=0 ink=0 Rin=500Meg  ; pins IN+ IN- V+ V- OUT
.model D D
.lib standard.dio
* RGB_1: Common Anode RGB
* RGB_2: Common Anode RGB
* RGB_3: Common Anode RGB
* RGB_5: Common Cathode RGB
* RGB_4: Common Cathode RGB
.lib UniversalOpamps2.sub
.backanno
.end